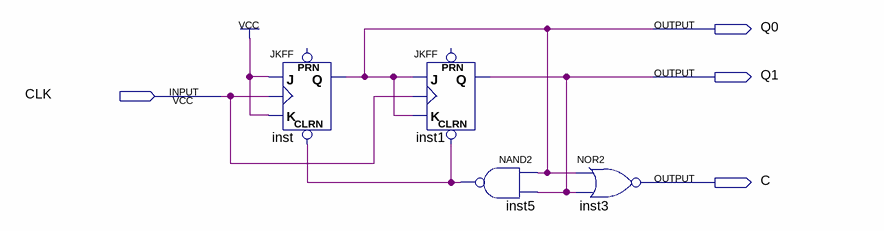
[diagram p0: schematic sheet]
// Quartus schematic DiagCont3.bdf as structural Verilog: 4 symbols, 4 pins
module DiagCont3 (
  input  CLK,
  output Q0,
  output Q1,
  output C
);

  wire inst5_out;

  JKFF inst (.CLRN(inst5_out), .K(1'b1), .J(1'b1), .CLK(CLK), .Q(Q0));  // open: PRN
  JKFF inst1 (.CLRN(inst5_out), .K(Q0), .J(Q0), .CLK(CLK), .Q(Q1));  // open: PRN
  nand inst5 (inst5_out, Q0, Q1);
  nor inst3 (C, Q0, Q1);
endmodule
